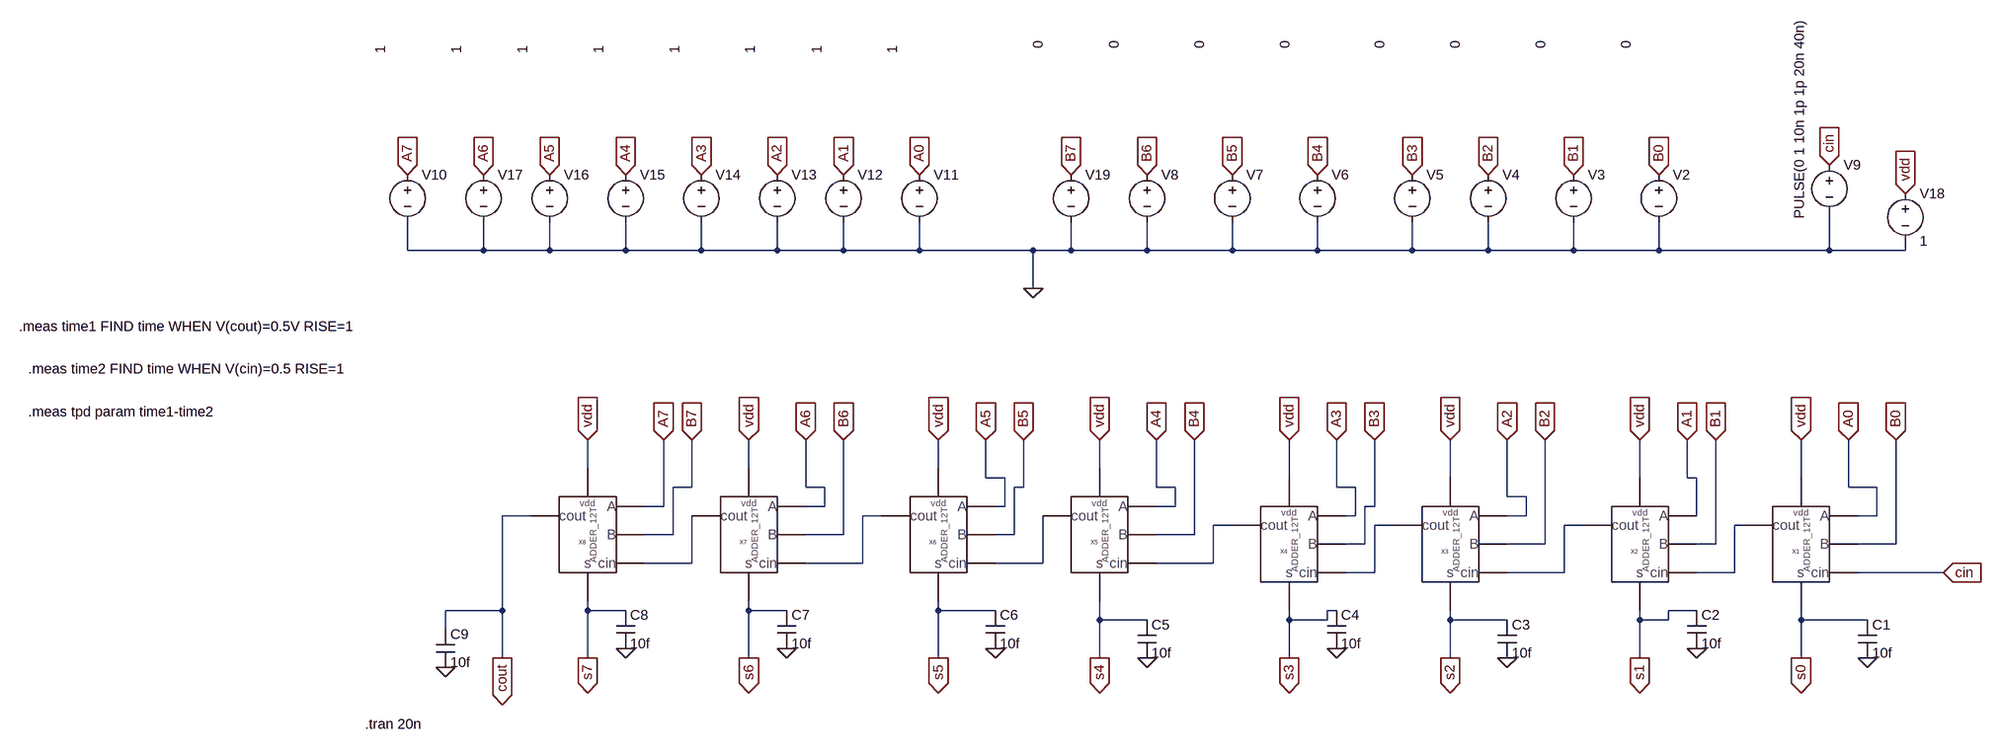
[diagram p0: schematic 8_BitAdder_96T_xnor.asc]
8_BitAdder_96T_xnor.asc, the LTspice schematic file:
Version 4
SHEET 1 2648 924
WIRE -1120 -176 -1120 -224
WIRE -992 -176 -992 -224
WIRE -992 -176 -1120 -176
WIRE -880 -176 -880 -224
WIRE -880 -176 -992 -176
WIRE -752 -176 -752 -224
WIRE -752 -176 -880 -176
WIRE -624 -176 -624 -224
WIRE -624 -176 -752 -176
WIRE -496 -176 -496 -224
WIRE -496 -176 -624 -176
WIRE -384 -176 -384 -224
WIRE -384 -176 -496 -176
WIRE -256 -176 -256 -224
WIRE -256 -176 -384 -176
WIRE -64 -176 -256 -176
WIRE 0 -176 0 -224
WIRE 0 -176 -64 -176
WIRE 128 -176 128 -224
WIRE 128 -176 0 -176
WIRE 272 -176 272 -224
WIRE 272 -176 128 -176
WIRE 416 -176 416 -224
WIRE 416 -176 272 -176
WIRE 576 -176 576 -224
WIRE 576 -176 416 -176
WIRE 704 -176 704 -224
WIRE 704 -176 576 -176
WIRE 848 -176 848 -224
WIRE 848 -176 704 -176
WIRE 992 -176 992 -224
WIRE 992 -176 848 -176
WIRE 1280 -176 1280 -240
WIRE 1280 -176 992 -176
WIRE 1408 -176 1408 -192
WIRE 1408 -176 1280 -176
WIRE -64 -112 -64 -176
WIRE -816 192 -816 144
WIRE -544 192 -544 144
WIRE -224 192 -224 144
WIRE 48 192 48 144
WIRE -144 208 -144 144
WIRE -112 208 -144 208
WIRE 368 208 368 144
WIRE 640 208 640 144
WIRE 960 208 960 144
WIRE 1040 208 1040 144
WIRE 1056 208 1040 208
WIRE 1232 208 1232 144
WIRE -640 224 -640 144
WIRE -640 224 -672 224
WIRE -448 224 -448 144
WIRE -416 224 -448 224
WIRE -80 224 -80 144
WIRE -80 224 -96 224
WIRE 144 224 144 144
WIRE 176 224 144 224
WIRE 448 224 448 144
WIRE 480 224 448 224
WIRE 1312 224 1312 144
WIRE 1360 224 1312 224
WIRE 736 240 736 144
WIRE 768 240 736 240
WIRE -688 256 -688 144
WIRE -688 256 -720 256
WIRE -416 256 -416 224
WIRE -416 256 -448 256
WIRE -112 256 -112 208
WIRE -112 256 -128 256
WIRE 176 256 176 224
WIRE 176 256 144 256
WIRE 512 256 512 144
WIRE 512 256 496 256
WIRE -912 272 -960 272
WIRE -320 272 -352 272
WIRE 480 272 480 224
WIRE 480 272 464 272
WIRE 768 272 768 240
WIRE 768 272 736 272
WIRE 1056 272 1056 208
WIRE 1360 272 1360 224
WIRE 1360 272 1328 272
WIRE 272 288 240 288
WIRE 544 288 512 288
WIRE 864 288 832 288
WIRE 1136 288 1120 288
WIRE -672 304 -672 224
WIRE -672 304 -720 304
WIRE -384 304 -384 144
WIRE -384 304 -448 304
WIRE -96 304 -96 224
WIRE -96 304 -128 304
WIRE 208 304 208 144
WIRE 208 304 144 304
WIRE 496 320 496 256
WIRE 496 320 464 320
WIRE 800 320 800 144
WIRE 800 320 736 320
WIRE 1088 320 1088 144
WIRE 1088 320 1056 320
WIRE 1392 320 1392 144
WIRE 1392 320 1328 320
WIRE -640 352 -640 272
WIRE -640 352 -720 352
WIRE -352 352 -352 272
WIRE -352 352 -448 352
WIRE -48 352 -48 272
WIRE -48 352 -128 352
WIRE 240 352 240 288
WIRE 240 352 144 352
WIRE 512 368 512 288
WIRE 512 368 464 368
WIRE 832 368 832 288
WIRE 832 368 736 368
WIRE 1120 368 1120 288
WIRE 1120 368 1056 368
WIRE 1472 368 1328 368
WIRE -960 432 -960 272
WIRE -960 432 -1056 432
WIRE -816 432 -816 416
WIRE -752 432 -816 432
WIRE -544 432 -544 416
WIRE -480 432 -544 432
WIRE -224 432 -224 416
WIRE -128 432 -224 432
WIRE 448 432 432 432
WIRE 1056 432 1008 432
WIRE 48 448 48 416
WIRE 128 448 48 448
WIRE 368 448 368 432
WIRE 432 448 432 432
WIRE 432 448 368 448
WIRE 640 448 640 432
WIRE 736 448 640 448
WIRE 960 448 960 432
WIRE 1008 448 1008 432
WIRE 1008 448 960 448
WIRE 1232 448 1232 432
WIRE 1344 448 1232 448
WIRE -1056 464 -1056 432
WIRE -960 512 -960 432
WIRE -816 512 -816 432
WIRE -544 512 -544 432
WIRE -224 512 -224 432
WIRE 48 512 48 448
WIRE 368 512 368 448
WIRE 640 512 640 448
WIRE 960 512 960 448
WIRE 1232 512 1232 448
FLAG 1312 144 A0
IOPIN 1312 144 In
FLAG 1040 144 A1
IOPIN 1040 144 In
FLAG 736 144 A2
IOPIN 736 144 In
FLAG 448 144 A3
IOPIN 448 144 In
FLAG 144 144 A4
IOPIN 144 144 In
FLAG -144 144 A5
IOPIN -144 144 In
FLAG -448 144 A6
IOPIN -448 144 In
FLAG -688 144 A7
IOPIN -688 144 In
FLAG 1392 144 B0
IOPIN 1392 144 In
FLAG 1088 144 B1
IOPIN 1088 144 In
FLAG 800 144 B2
IOPIN 800 144 In
FLAG 512 144 B3
IOPIN 512 144 In
FLAG 208 144 B4
IOPIN 208 144 In
FLAG -80 144 B5
IOPIN -80 144 In
FLAG -384 144 B6
IOPIN -384 144 In
FLAG -640 144 B7
IOPIN -640 144 In
FLAG 1232 144 vdd
IOPIN 1232 144 In
FLAG 960 144 vdd
IOPIN 960 144 In
FLAG 640 144 vdd
IOPIN 640 144 In
FLAG 368 144 vdd
IOPIN 368 144 In
FLAG 48 144 vdd
IOPIN 48 144 In
FLAG -224 144 vdd
IOPIN -224 144 In
FLAG -544 144 vdd
IOPIN -544 144 In
FLAG -816 144 vdd
IOPIN -816 144 In
FLAG 1232 512 s0
IOPIN 1232 512 Out
FLAG 960 512 s1
IOPIN 960 512 Out
FLAG 640 512 s2
IOPIN 640 512 Out
FLAG 368 512 s3
IOPIN 368 512 Out
FLAG 48 512 s4
IOPIN 48 512 Out
FLAG -224 512 s5
IOPIN -224 512 Out
FLAG -544 512 s6
IOPIN -544 512 Out
FLAG -816 512 s7
IOPIN -816 512 Out
FLAG -960 512 cout
IOPIN -960 512 Out
FLAG 1280 -320 cin
IOPIN 1280 -320 In
FLAG -256 -304 A0
IOPIN -256 -304 In
FLAG -384 -304 A1
IOPIN -384 -304 In
FLAG -496 -304 A2
IOPIN -496 -304 In
FLAG -624 -304 A3
IOPIN -624 -304 In
FLAG 416 -304 B4
IOPIN 416 -304 In
FLAG 272 -304 B5
IOPIN 272 -304 In
FLAG 128 -304 B6
IOPIN 128 -304 In
FLAG 0 -304 B7
IOPIN 0 -304 In
FLAG -752 -304 A4
IOPIN -752 -304 In
FLAG -880 -304 A5
IOPIN -880 -304 In
FLAG -992 -304 A6
IOPIN -992 -304 In
FLAG -1120 -304 A7
IOPIN -1120 -304 In
FLAG 992 -304 B0
IOPIN 992 -304 In
FLAG 848 -304 B1
IOPIN 848 -304 In
FLAG 704 -304 B2
IOPIN 704 -304 In
FLAG 576 -304 B3
IOPIN 576 -304 In
FLAG -64 -112 0
FLAG 1408 -272 vdd
IOPIN 1408 -272 In
FLAG 1472 368 cin
IOPIN 1472 368 In
FLAG 1344 512 0
FLAG 1056 496 0
FLAG 736 512 0
FLAG 448 496 0
FLAG 128 512 0
FLAG -128 496 0
FLAG -480 496 0
FLAG -752 496 0
FLAG -1056 528 0
SYMBOL voltage 1408 -288 R0
WINDOW 123 0 0 Left 0
WINDOW 39 0 0 Left 0
SYMATTR InstName V18
SYMATTR Value 1
SYMBOL voltage 992 -320 R0
WINDOW 123 0 0 Left 0
WINDOW 39 0 0 Left 0
WINDOW 3 -55 -210 VRight 2
SYMATTR Value 0
SYMATTR InstName V2
SYMBOL voltage -256 -320 R0
WINDOW 123 0 0 Left 0
WINDOW 39 0 0 Left 0
WINDOW 3 -45 -202 VRight 2
SYMATTR Value 1
SYMATTR InstName V11
SYMBOL voltage -1120 -320 R0
WINDOW 123 0 0 Left 0
WINDOW 39 0 0 Left 0
WINDOW 3 -45 -202 VRight 2
SYMATTR Value 1
SYMATTR InstName V10
SYMBOL voltage -384 -320 R0
WINDOW 123 0 0 Left 0
WINDOW 39 0 0 Left 0
WINDOW 3 -45 -202 VRight 2
SYMATTR Value 1
SYMATTR InstName V12
SYMBOL voltage -496 -320 R0
WINDOW 123 0 0 Left 0
WINDOW 39 0 0 Left 0
WINDOW 3 -45 -202 VRight 2
SYMATTR Value 1
SYMATTR InstName V13
SYMBOL voltage -624 -320 R0
WINDOW 123 0 0 Left 0
WINDOW 39 0 0 Left 0
WINDOW 3 -45 -202 VRight 2
SYMATTR Value 1
SYMATTR InstName V14
SYMBOL voltage -752 -320 R0
WINDOW 123 0 0 Left 0
WINDOW 39 0 0 Left 0
WINDOW 3 -45 -202 VRight 2
SYMATTR Value 1
SYMATTR InstName V15
SYMBOL voltage -880 -320 R0
WINDOW 123 0 0 Left 0
WINDOW 39 0 0 Left 0
WINDOW 3 -45 -202 VRight 2
SYMATTR Value 1
SYMATTR InstName V16
SYMBOL voltage -992 -320 R0
WINDOW 123 0 0 Left 0
WINDOW 39 0 0 Left 0
WINDOW 3 -45 -202 VRight 2
SYMATTR Value 1
SYMATTR InstName V17
SYMBOL voltage 0 -320 R0
WINDOW 123 0 0 Left 0
WINDOW 39 0 0 Left 0
WINDOW 3 -55 -210 VRight 2
SYMATTR Value 0
SYMATTR InstName V19
SYMBOL voltage 848 -320 R0
WINDOW 123 0 0 Left 0
WINDOW 39 0 0 Left 0
WINDOW 3 -55 -210 VRight 2
SYMATTR Value 0
SYMATTR InstName V3
SYMBOL voltage 704 -320 R0
WINDOW 123 0 0 Left 0
WINDOW 39 0 0 Left 0
WINDOW 3 -55 -210 VRight 2
SYMATTR Value 0
SYMATTR InstName V4
SYMBOL voltage 576 -320 R0
WINDOW 123 0 0 Left 0
WINDOW 39 0 0 Left 0
WINDOW 3 -55 -210 VRight 2
SYMATTR Value 0
SYMATTR InstName V5
SYMBOL voltage 416 -320 R0
WINDOW 123 0 0 Left 0
WINDOW 39 0 0 Left 0
WINDOW 3 -55 -210 VRight 2
SYMATTR Value 0
SYMATTR InstName V6
SYMBOL voltage 272 -320 R0
WINDOW 123 0 0 Left 0
WINDOW 39 0 0 Left 0
WINDOW 3 -55 -210 VRight 2
SYMATTR Value 0
SYMATTR InstName V7
SYMBOL voltage 128 -320 R0
WINDOW 123 0 0 Left 0
WINDOW 39 0 0 Left 0
WINDOW 3 -55 -210 VRight 2
SYMATTR Value 0
SYMATTR InstName V8
SYMBOL voltage 1280 -336 R0
WINDOW 123 0 0 Left 0
WINDOW 39 0 0 Left 0
WINDOW 3 -50 -231 VRight 2
SYMATTR Value PULSE(0 1 10n 1p 1p 20n 40n)
SYMATTR InstName V9
SYMBOL cap 1328 448 R0
SYMATTR InstName C1
SYMATTR Value 10f
SYMBOL cap 1040 432 R0
SYMATTR InstName C2
SYMATTR Value 10f
SYMBOL cap 720 448 R0
SYMATTR InstName C3
SYMATTR Value 10f
SYMBOL cap 432 432 R0
SYMATTR InstName C4
SYMATTR Value 10f
SYMBOL cap 112 448 R0
SYMATTR InstName C5
SYMATTR Value 10f
SYMBOL cap -144 432 R0
SYMATTR InstName C6
SYMATTR Value 10f
SYMBOL cap -496 432 R0
SYMATTR InstName C7
SYMATTR Value 10f
SYMBOL cap -768 432 R0
SYMATTR InstName C8
SYMATTR Value 10f
SYMBOL cap -1072 464 R0
SYMATTR InstName C9
SYMATTR Value 10f
SYMBOL SingleBitAdder_12T_xnor 1200 304 R0
SYMATTR InstName X1
SYMBOL SingleBitAdder_12T_xnor 928 304 R0
SYMATTR InstName X2
SYMBOL SingleBitAdder_12T_xnor 608 304 R0
SYMATTR InstName X3
SYMBOL SingleBitAdder_12T_xnor 336 304 R0
SYMATTR InstName X4
SYMBOL SingleBitAdder_12T_xnor 16 288 R0
SYMATTR InstName X5
SYMBOL SingleBitAdder_12T_xnor -256 288 R0
SYMATTR InstName X6
SYMBOL SingleBitAdder_12T_xnor -576 288 R0
SYMATTR InstName X7
SYMBOL SingleBitAdder_12T_xnor -848 288 R0
SYMATTR InstName X8
TEXT -1192 624 Left 2 !.tran 20n
TEXT -1776 -48 Left 2 !.meas time1 FIND time WHEN V(cout)=0.5V RISE=1
TEXT -1760 24 Left 2 !.meas time2 FIND time WHEN V(cin)=0.5 RISE=1
TEXT -1760 96 Left 2 !.meas tpd param time1-time2

The netlist it stands for:
* 8_BitAdder_96T_xnor.asc
V18 vdd 0 1
V2 B0 0 0
V11 A0 0 1
V10 A7 0 1
V12 A1 0 1
V13 A2 0 1
V14 A3 0 1
V15 A4 0 1
V16 A5 0 1
V17 A6 0 1
V19 B7 0 0
V3 B1 0 0
V4 B2 0 0
V5 B3 0 0
V6 B4 0 0
V7 B5 0 0
V8 B6 0 0
V9 cin 0 PULSE(0 1 10n 1p 1p 20n 40n)
C1 s0 0 10f
C2 s1 0 10f
C3 s2 0 10f
C4 s3 0 10f
C5 s4 0 10f
C6 s5 0 10f
C7 s6 0 10f
C8 s7 0 10f
C9 cout 0 10f
XX1 A0 B0 cin s0 N005 vdd SingleBitAdder_12T_xnor  ; pins A B cin s cout vdd
XX2 A1 B1 N005 s1 N004 vdd SingleBitAdder_12T_xnor  ; pins A B cin s cout vdd
XX3 A2 B2 N004 s2 N003 vdd SingleBitAdder_12T_xnor  ; pins A B cin s cout vdd
XX4 A3 B3 N003 s3 N002 vdd SingleBitAdder_12T_xnor  ; pins A B cin s cout vdd
XX5 A4 B4 N002 s4 N007 vdd SingleBitAdder_12T_xnor  ; pins A B cin s cout vdd
XX6 A5 B5 N007 s5 N001 vdd SingleBitAdder_12T_xnor  ; pins A B cin s cout vdd
XX7 A6 B6 N001 s6 N006 vdd SingleBitAdder_12T_xnor  ; pins A B cin s cout vdd
XX8 A7 B7 N006 s7 cout vdd SingleBitAdder_12T_xnor  ; pins A B cin s cout vdd
.tran 20n
.meas time1 FIND time WHEN V(cout)=0.5V RISE=1
.meas time2 FIND time WHEN V(cin)=0.5 RISE=1
.meas tpd param time1-time2
.backanno
.end